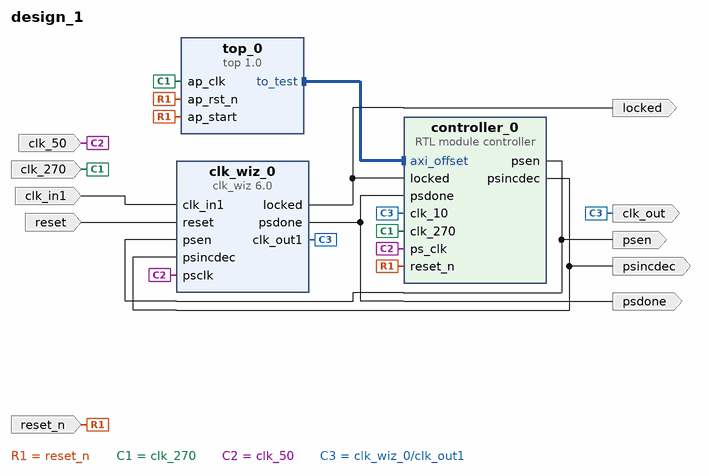
[diagram p0: block diagram of the top level]
# Vivado block design design_1, xczu48dr-ffvg1517-2-e, Vivado 2024.2
create_bd_design design_1

create_bd_port -dir I clk_in1
create_bd_port -dir I clk_270
create_bd_port -dir I clk_50
create_bd_port -dir I reset_n
create_bd_port -dir I reset
create_bd_port -dir O clk_out
create_bd_port -dir O psdone
create_bd_port -dir O locked
create_bd_port -dir O psen
create_bd_port -dir O psincdec

create_bd_cell -type ip -vlnv xilinx.com:hls:top:1.0 top_0
create_bd_cell -type module -reference controller controller_0
create_bd_cell -type ip -vlnv xilinx.com:ip:clk_wiz:6.0 clk_wiz_0
set_property -dict [list \
  CONFIG.AXI_DRP false \
  CONFIG.CLKOUT1_DRIVES Buffer \
  CONFIG.CLKOUT1_JITTER 115.831 \
  CONFIG.CLKOUT1_PHASE_ERROR 87.180 \
  CONFIG.CLKOUT2_DRIVES Buffer \
  CONFIG.CLKOUT3_DRIVES Buffer \
  CONFIG.CLKOUT4_DRIVES Buffer \
  CONFIG.CLKOUT5_DRIVES Buffer \
  CONFIG.CLKOUT6_DRIVES Buffer \
  CONFIG.CLKOUT7_DRIVES Buffer \
  CONFIG.FEEDBACK_SOURCE FDBK_AUTO \
  CONFIG.MMCM_BANDWIDTH OPTIMIZED \
  CONFIG.MMCM_CLKFBOUT_MULT_F 12.000 \
  CONFIG.MMCM_CLKOUT0_DIVIDE_F 12.000 \
  CONFIG.MMCM_CLKOUT0_USE_FINE_PS true \
  CONFIG.MMCM_COMPENSATION AUTO \
  CONFIG.OVERRIDE_MMCM true \
  CONFIG.PHASE_DUTY_CONFIG false \
  CONFIG.PRIMITIVE MMCM \
  CONFIG.SECONDARY_SOURCE Single_ended_clock_capable_pin \
  CONFIG.USE_DYN_PHASE_SHIFT true \
  CONFIG.USE_DYN_RECONFIG false \
  CONFIG.USE_FREQ_SYNTH true \
  CONFIG.USE_PHASE_ALIGNMENT false \
] [get_bd_cells clk_wiz_0]

# ---- connections ----

connect_bd_intf_net [get_bd_intf_pins controller_0/axi_offset] [get_bd_intf_pins top_0/to_test]
connect_bd_net [get_bd_ports reset_n] [get_bd_pins top_0/ap_rst_n] [get_bd_pins top_0/ap_start] [get_bd_pins controller_0/reset_n]
connect_bd_net -net clk_270_1 [get_bd_ports clk_270] [get_bd_pins top_0/ap_clk] [get_bd_pins controller_0/clk_270]
connect_bd_net -net clk_50_1 [get_bd_ports clk_50] [get_bd_pins clk_wiz_0/psclk] [get_bd_pins controller_0/ps_clk]
connect_bd_net -net clk_in1_1 [get_bd_ports clk_in1] [get_bd_pins clk_wiz_0/clk_in1]
connect_bd_net [get_bd_pins clk_wiz_0/clk_out1] [get_bd_ports clk_out] [get_bd_pins controller_0/clk_10]
connect_bd_net [get_bd_pins clk_wiz_0/locked] [get_bd_ports locked] [get_bd_pins controller_0/locked]
connect_bd_net [get_bd_pins clk_wiz_0/psdone] [get_bd_ports psdone] [get_bd_pins controller_0/psdone]
connect_bd_net [get_bd_pins controller_0/psen] [get_bd_pins clk_wiz_0/psen] [get_bd_ports psen]
connect_bd_net [get_bd_pins controller_0/psincdec] [get_bd_pins clk_wiz_0/psincdec] [get_bd_ports psincdec]
connect_bd_net [get_bd_ports reset] [get_bd_pins clk_wiz_0/reset]

validate_bd_design
save_bd_design
